# Altium schematic sheet FPGA_52_I2C_ADC_DAC.SchDoc
size B; Organization: Altium Limited; Address1: L3, 12a Rodborough Rd; Address2: Frenchs Forest; Address3: NSW; Address4: Australia 2086; DocumentNumber: 1; SheetNumber: 1; SheetTotal: 1
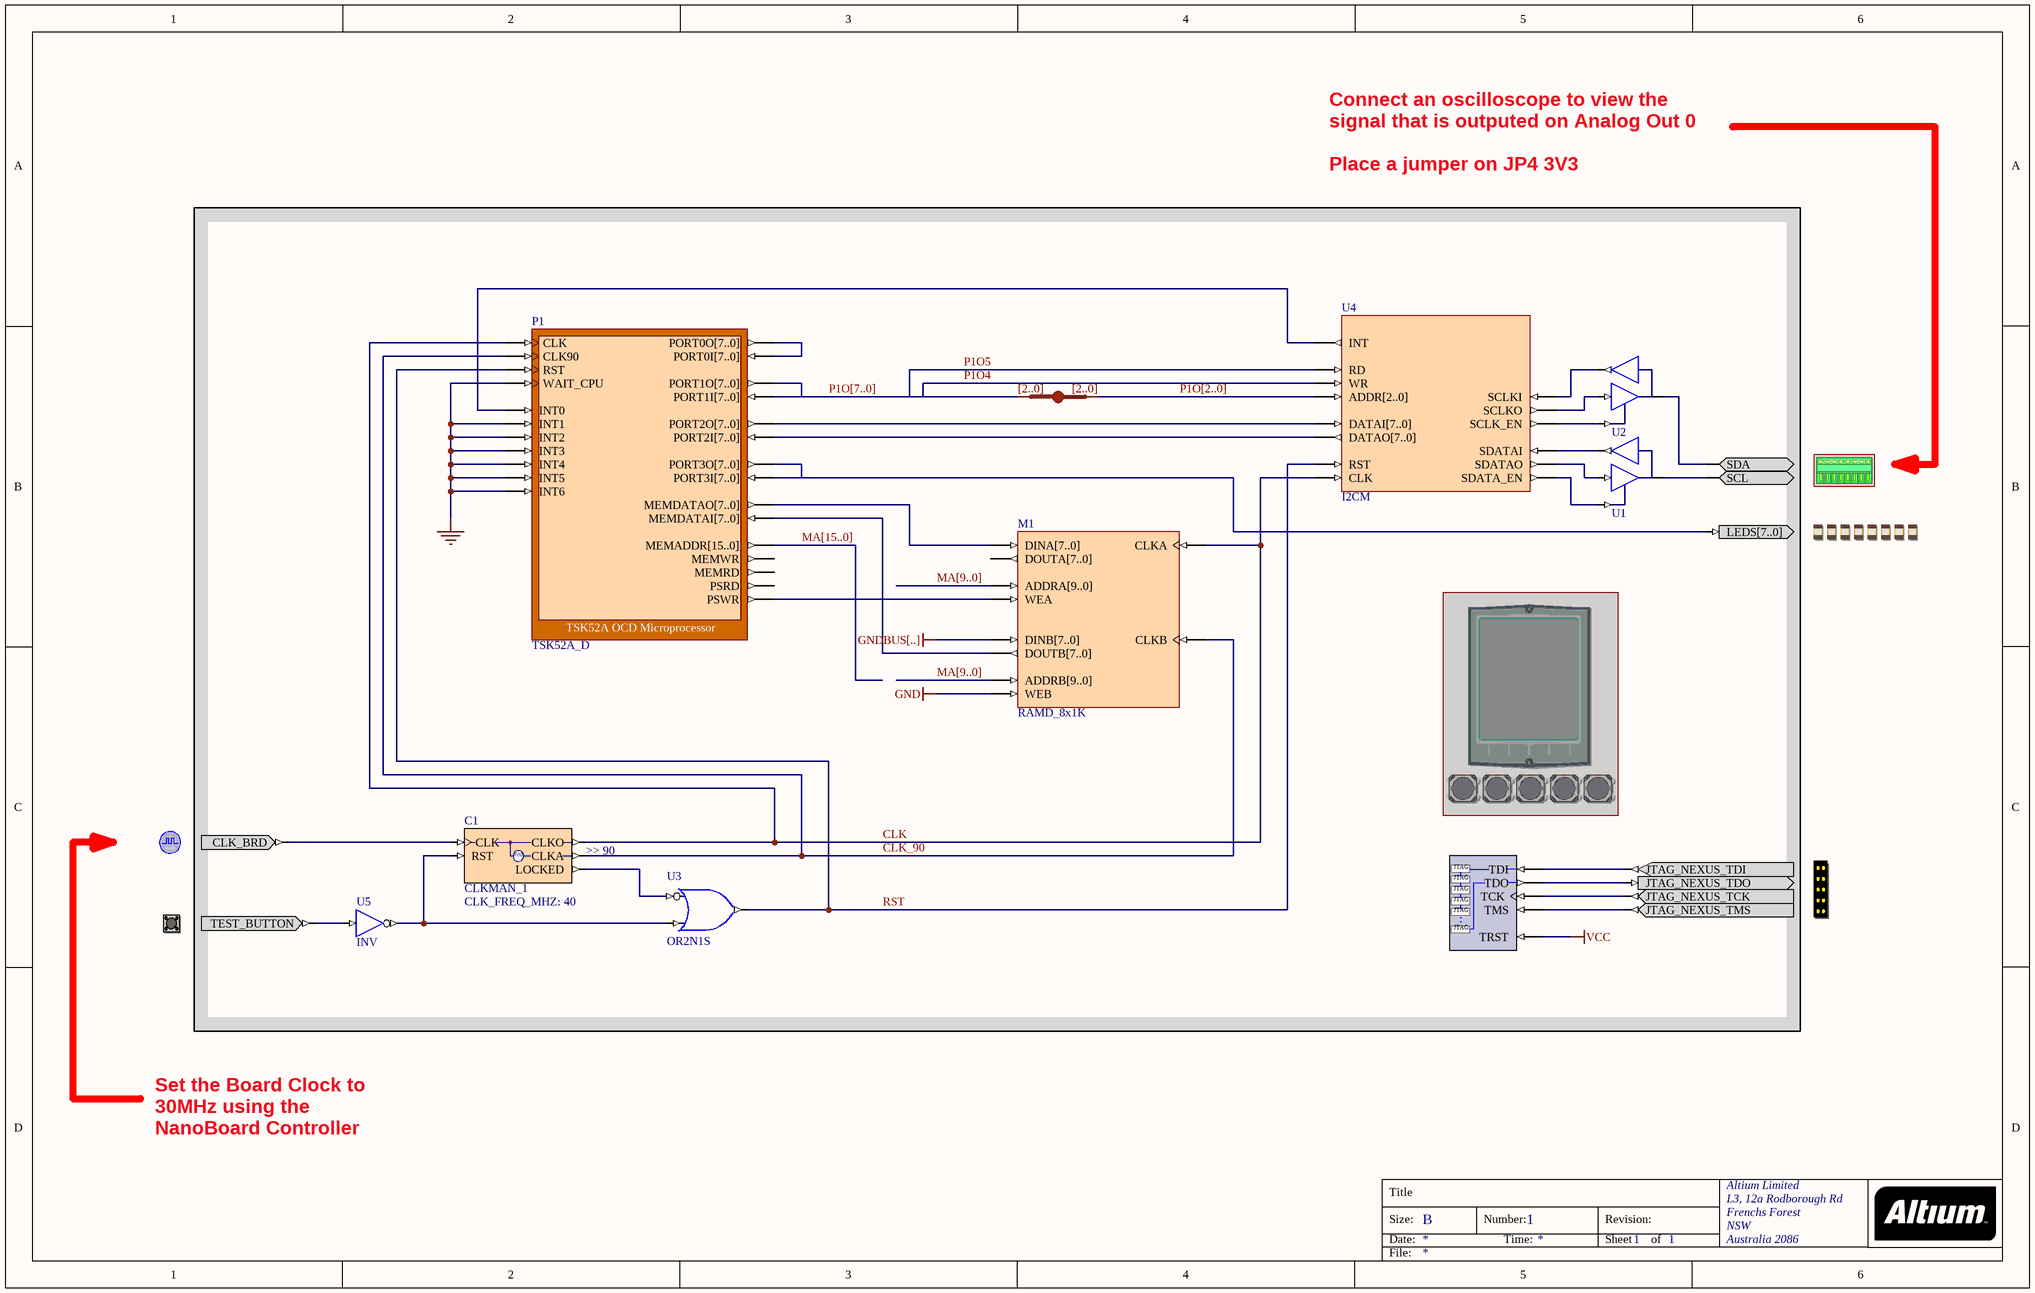
[diagram p0: FPGA_52_I2C_ADC_DAC.SchDoc]

## Parts
(Parts that share a designator on the sheet are numbered #1, #2 ... from top to bottom, then left to right.)
?#1  ADCDAC_I2C  (value not drawn)
?#2  LED  (value not drawn)
?#3  FIRMWARE_TFT_ENABLE  (value not drawn)  (masked out: inside a compile mask, not in the netlist)
?#4  FIRMWARE_BUTTONS_ENABLE  (value not drawn)  (masked out: inside a compile mask, not in the netlist)
?#5  CLOCK_BOARD  (value not drawn)
?#6  NEXUS_JTAG_CONNECTOR  (value not drawn)
?#7  TEST_BUTTON  (value not drawn)
C1  CLKMAN_1  CLK_FREQ_MHZ: 40  ClkA_Operation: >> 90
M1  RAMD_8x1K
NEXUS_JTAG_PORT  NEXUS_JTAG_PORT  (value not drawn)
P1  TSK52A_D
U1  IOBUF  (value not drawn)
U2  IOBUF  (value not drawn)
U3  OR2N1S
U4  I2CM
U5  INV
U6  IndexA: [2..0]  (hidden comment: JB)

## Nets
GND: M1.WEB P1.INT1 P1.INT2 P1.INT3 P1.INT4 P1.INT5 P1.INT6 P1.WAIT_CPU
GNDBUS[..]: M1.DINB[7..0]
VCC: NEXUS_JTAG_PORT.TRST
CLK: C1.CLKO M1.CLKA P1.CLK U4.CLK
CLK_90: C1.CLKA M1.CLKB P1.CLK90
MA[9..0]: M1.ADDRA[9..0] M1.ADDRB[9..0]
MA[15..0]: P1.MEMADDR[15..0]
P1O4: U4.WR
P1O5: U4.RD
P1O[2..0]: U4.ADDR[2..0] U6.B[0..0]
P1O[7..0]: P1.PORT1I[7..0] P1.PORT1O[7..0] U6.A[0..0]
RST: P1.RST U3.O U4.RST
Net?#1_SCL: ?#1.SCL U1.IO
Net?#1_SDA: ?#1.SDA U2.IO
Net?#2_LEDS[7..0]: ?#2.LEDS[7..0] P1.PORT3I[7..0] P1.PORT3O[7..0]
Net?#5_CLK_BRD: ?#5.CLK_BRD C1.CLK
Net?#6_JTAG_NEXUS_TCK: ?#6.JTAG_NEXUS_TCK NEXUS_JTAG_PORT.TCK
Net?#6_JTAG_NEXUS_TDI: ?#6.JTAG_NEXUS_TDI NEXUS_JTAG_PORT.TDI
Net?#6_JTAG_NEXUS_TDO: ?#6.JTAG_NEXUS_TDO NEXUS_JTAG_PORT.TDO
Net?#6_JTAG_NEXUS_TMS: ?#6.JTAG_NEXUS_TMS NEXUS_JTAG_PORT.TMS
Net?#7_TEST_BUTTON: ?#7.TEST_BUTTON U5.I
NetC1_LOCKED: C1.LOCKED U3.I0
NetC1_RST: C1.RST U3.I1 U5.O
NetM1_DINA[7..0]: M1.DINA[7..0] P1.MEMDATAO[7..0]
NetM1_DOUTB[7..0]: M1.DOUTB[7..0] P1.MEMDATAI[7..0]
NetM1_WEA: M1.WEA P1.PSWR
NetP1_INT0: P1.INT0 U4.INT
NetP1_PORT0I[7..0]: P1.PORT0I[7..0] P1.PORT0O[7..0]
NetP1_PORT2I[7..0]: P1.PORT2I[7..0] U4.DATAO[7..0]
NetP1_PORT2O[7..0]: P1.PORT2O[7..0] U4.DATAI[7..0]
NetU1_I: U1.I U4.SDATAO
NetU1_O: U1.O U4.SDATAI
NetU1_T: U1.T U4.SDATA_EN
NetU2_I: U2.I U4.SCLKO
NetU2_O: U2.O U4.SCLKI
NetU2_T: U2.T U4.SCLK_EN

Not connected (* = marked no-connect by the designer): M1 DOUTA[7..0]; P1 MEMRD MEMWR PSRD

## Buses and harness runs
bus MA[9..0]
bus MA[15..0]
bus P1O[2..0]
bus P1O[7..0]

## Notes on the sheet
- Connect an oscilloscope to view the signal that is outputed on Analog Out 0
  Place a jumper on JP4 3V3
- Set the Board Clock to 30MHz using the NanoBoard Controller
- Title
- Size:
- Date:
- B
- Number:
- Time:
- Revision:
- Sheet
- of
- File:
- (in symbol CLKMAN_1) F(x)
- (in symbol NEXUS_JTAG_PORT) JTAG; .

## Library data of the parts
?#1 = ADCDAC_I2C: Analog Digital/ Digital Analog Converter, I2C Interface; PortComponent: True; Published: 19-Nov-2003; Publisher: Altium Limited; HelpURL: TR0143 Technical Reference Manual for Altium's Desktop NanoBoard NB2DSK01.pdf#page=48; UseInDSF: True
?#2 = LED: Bank of eight Red LEDs; PortComponent: True; Published: 19-Nov-2003; Publisher: Altium Limited; HelpURL: TR0143 Technical Reference Manual for Altium's Desktop NanoBoard NB2DSK01.pdf#page=51
?#3 = FIRMWARE_TFT_ENABLE: TFT LCD Panel; PortComponent: True; Published: 22-Jan-2007; Publisher: Altium Limited; HelpURL: TR0143 Technical Reference Manual for Altium's Desktop NanoBoard NB2DSK01.pdf#page=50
?#4 = FIRMWARE_BUTTONS_ENABLE: Generic User Buttons; PortComponent: True; Published: 16-Apr-2007; Publisher: Altium Limited; HelpURL: TR0143 Technical Reference Manual for Altium's Desktop NanoBoard NB2DSK01.pdf#page=53
?#5 = CLOCK_BOARD: Global System Clock Supply; PortComponent: True; Published: 19-Nov-2003; Publisher: Altium Limited; HelpURL: TR0143 Technical Reference Manual for Altium's Desktop NanoBoard NB2DSK01.pdf#page=41; UseInDSF: True
?#6 = NEXUS_JTAG_CONNECTOR: JTAG Port; PortComponent: True; Published: 19-Nov-2003; Publisher: Altium Limited; HelpURL: TR0102 NanoBoard Technical Reference Manual - NB1.pdf#page=33
?#7 = TEST_BUTTON: Test / Reset Button; PortComponent: True; Published: 19-Nov-2003; Publisher: Altium Limited; HelpURL: TR0143 Technical Reference Manual for Altium's Desktop NanoBoard NB2DSK01.pdf#page=53
C1 = CLKMAN_1: Single Operational Output Clock Manager; Clk_Count: 1; Published: 5-Jul-2004; Publisher: Altium Limited; Core Revision: 1.00.00; Nexus_Core: ClockManager; HelpURL: CR0118 FPGA Generic Library Guide.pdf#page=148; Functional Class: Clock Manager; Port Size: 1
M1 = RAMD_8x1K: Dual Port Random Access Memory; Memory_DepthA: 1024; Memory_Type: RAM_DualPortBlock; Memory_WidthA: 8; Memory_ClockEdge: Rising; Nexus_Core: Memory_Program; Published: 13/01/2004; Publisher: Altium Hobart Technology Center; Memory_DepthB: 1024; Memory_WidthB: 8
NEXUS_JTAG_PORT = NEXUS_JTAG_PORT: Soft Nexus-Chain Connector; NEXUS_JTAG_CONNECTOR: True; Published: 18-Dec-2003; Publisher: Altium Limited
P1 = TSK52A_D: TSK52A OCD Microprocessor; NEXUS_CORE: Processor_OCDS; NEXUS_JTAG_DEVICE: True; NEXUS_JTAG_ORDER: 0; ChildModel1: TSK52A_D_DRAM8X256; ChildCore1: M1; Published: 1/12/2003; Publisher: Altium Hobart Technology Centre; Core Revision: 1.00.00
U1 U2 = IOBUF: Input/Output Buffer; ArchiveName: GENERIC; Published: 18-Nov-2003; Publisher: Altium Limited; Xilinx Equivalent: IOBUF; Core Revision: 1.00.00
U3 = OR2N1S: 2-Input OR Gate with Active Low A Input, Single Pin Version; Xilinx Equivalent: OR2B1; ArchiveName: GENERIC; VHDLIB_SIM: GENERIC_LIB; Published: 29-Jan-2004; Publisher: Altium Limited; Core Revision: 1.00.00
U4 = I2CM: I2C Master; Published: 7/01/2004; Publisher: Altium Hobart Technology Centre; Core Revision: 1.00.00
U5 = INV: Inverter; ArchiveName: GENERIC; VHDLIB_SIM: GENERIC_LIB; Published: 29-Jan-2004; Publisher: Altium Limited; Xilinx Equivalent: INV; Core Revision: 1.00.00
U6 = JB: System BUS Joiner; ArchiveName: GENERIC; Published: 18-Dec-2003; Publisher: Altium Limited; Core Revision: 1.00.00; IndexB: [2..0]